# Altium schematic sheet MPU6050_Schematic.SchDoc
size A4
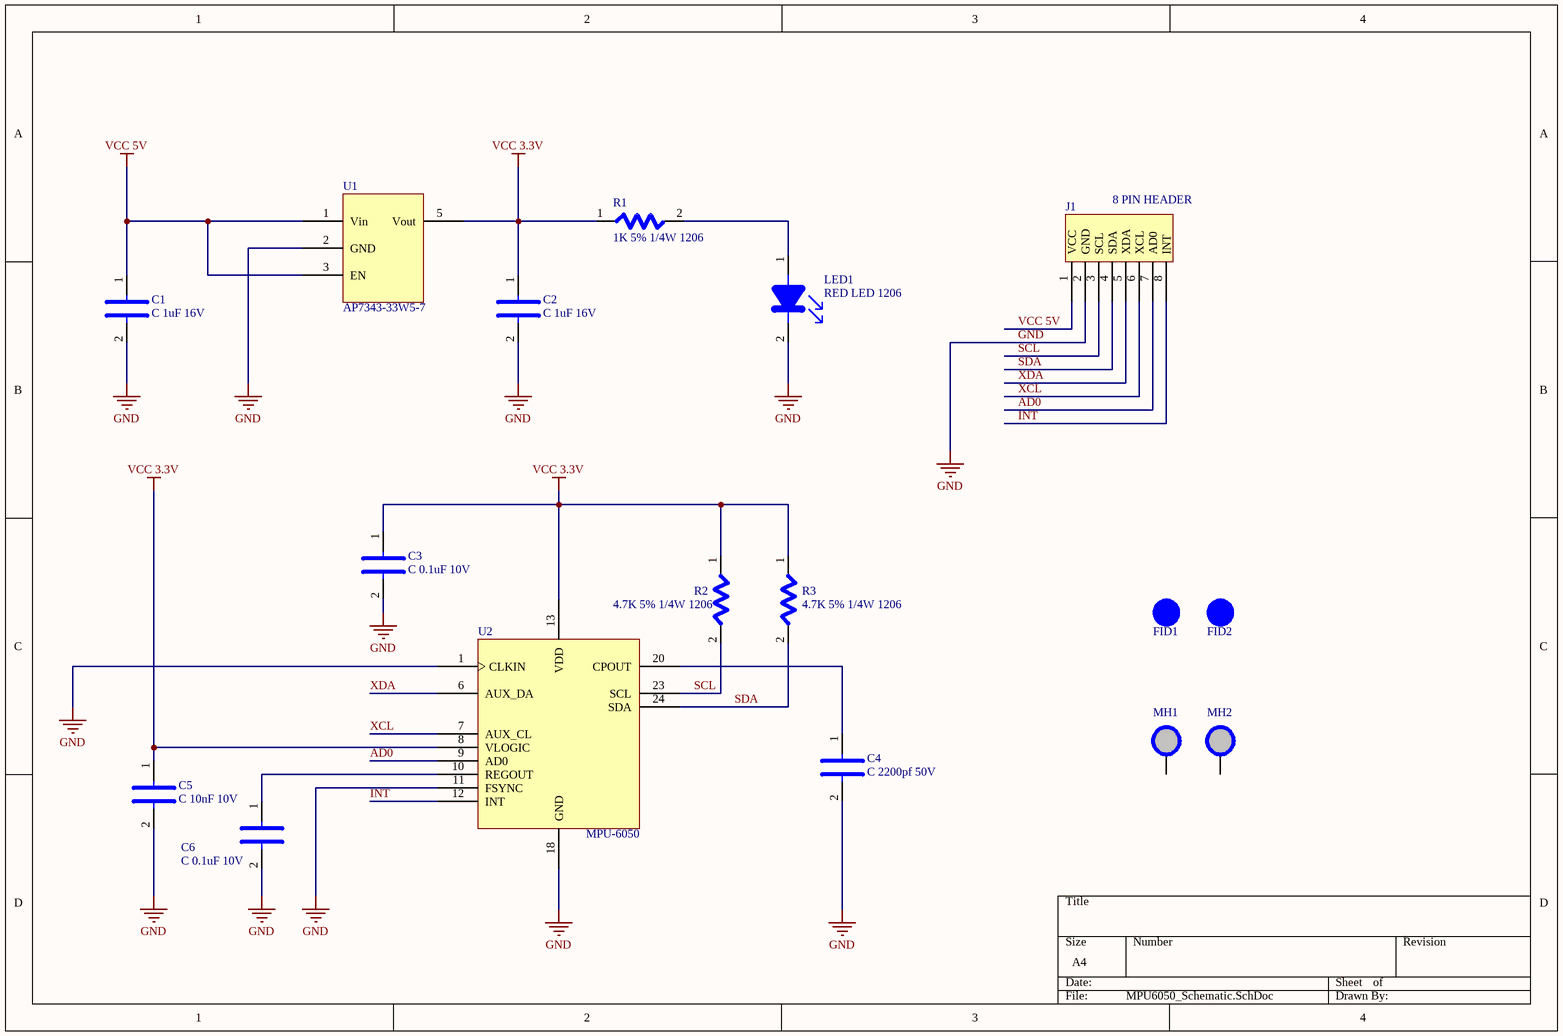
[diagram p0: MPU6050_Schematic.SchDoc]

## Parts
C1  C 1uF 16V  [CAP CER 1UF 10V X7R 1206]
C2  C 1uF 16V  [CAP CER 1UF 10V X7R 1206]
C3  C 0.1uF 10V  [CAP CER 0.1UF 10V X7R 1206]
C4  C 2200pf 50V  [CAP CER 2200PF 50V NP0 1206]
C5  C 10nF 10V  [CAP CER 1206 10NF 10V ULTRA STAB]
C6  C 0.1uF 10V  [CAP CER 0.1UF 10V X7R 1206]
FID1  FID_1mm  [FID_40_120]  (value not drawn)  (no BOM)
FID2  FID_1mm  [FID_40_120]  (value not drawn)  (no BOM)
J1  8 PIN HEADER  [CONN HEADER VERT 8POS 3.96MM]
LED1  RED LED 1206  [RES SMD 1K OHM 5% 1/4W 1206]
MH1  MH_3.2mmD  [MH 7.4mmD 3.2mmDirll No plated]  (value not drawn)  (no BOM)
MH2  MH_3.2mmD  [MH 7.4mmD 3.2mmDirll No plated]  (value not drawn)  (no BOM)
R1  1K 5% 1/4W 1206  [RES SMD 1K OHM 5% 1/4W 1206]
R2  4.7K 5% 1/4W 1206  [RES SMD 4.7K OHM 5% 1/4W 1206]
R3  4.7K 5% 1/4W 1206  [RES SMD 4.7K OHM 5% 1/4W 1206]
U1  AP7343-33W5-7  [AP7343-33W5-7]
U2  MPU-6050  [MPU6050]

## Nets
GND: C1.2 C2.2 C3.2 C4.2 C5.2 C6.2 J1.2(GND) LED1.2 U1.2(GND) U2.1(CLKIN) U2.11(FSYNC) U2.18(GND)
VCC 3.3V: C2.1 C3.1 C5.1 R1.1 R2.1 R3.1 U1.5(Vout) U2.8(VLOGIC) U2.13(VDD)
VCC 5V: C1.1 J1.1(VCC) U1.1(Vin) U1.3(EN)
AD0: J1.7(AD0) U2.9(AD0)
INT: J1.8(INT) U2.12(INT)
SCL: J1.3(SCL) R2.2 U2.23(SCL)
SDA: J1.4(SDA) R3.2 U2.24(SDA)
XCL: J1.6(XCL) U2.7(AUX_CL)
XDA: J1.5(XDA) U2.6(AUX_DA)
NetC4_1: C4.1 U2.20(CPOUT)
NetC6_1: C6.1 U2.10(REGOUT)
NetLED1_1: LED1.1 R1.2

Not connected (* = marked no-connect by the designer): MH1 1; MH2 1

## Library data of the parts
C1 C2 = CAP CER 1UF 10V X7R 1206: 1 µF ±10% 10V Capacitores cerámicos X7R 1206 (3216 métrico); Manufacturer: KEMET; Package/Case: 1206 (3216 métrico); Supplier: digikey; Supplier Part Number: 399-13193-1-ND; Package: Cinta cortada; Mount: Surface; Datasheet: https://content.kemet.com/datasheets/KEM_C1002_X7R_SMD.pdf; Pricing: 1=U$D0.78; 10=U$D0.578; 50=U$D0.462
C3 C6 = CAP CER 0.1UF 10V X7R 1206: 0.1 µF ±10% 10V Capacitores cerámicos X7R 1206 (3216 métrico); Manufacturer: KEMET; Package/Case: 1206 (3216 métrico); Supplier: digikey; Supplier Part Number: 399-15539-1-ND; Package: Cinta cortada; Mount: Surface; Datasheet: https://connect.kemet.com:7667/gateway/IntelliData-ComponentDocumentation/1.0/download/datasheet/C1206C104K8RACTU; Pricing: 1=U$D0.43; 10=U$D0.296; 50=U$D0.207
C4 = CAP CER 2200PF 50V NP0 1206: Manufacturer: KEMET; Package/Case: 1206 (3216 métrico); Supplier: digikey; Supplier Part Number: 399-C1206C222J5GACAUTOCT-ND; Package: Cinta cortada; Mount: Surface; Datasheet: https://content.kemet.com/datasheets/KEM_C1022_C0G_AUTO_SMD.pdf; Pricing: 1=U$D0.46; 10=U$D0.32; 50=U$D0.22
C5 = CAP CER 1206 10NF 10V ULTRA STAB: 10000 pF ±1% 10V Capacitores cerámicos X8R 1206 (3216 métrico); Manufacturer: KEMET; Package/Case: 1206 (3216 métrico); Supplier: digikey; Supplier Part Number: C1206C103F8HAC7800-ND; Package: Cinta y rollo; Mount: Surface; Datasheet: https://connect.kemet.com:7667/gateway/IntelliData-ComponentDocumentation/1.0/download/datasheet/C1206C103F8HAC7800; Pricing: 4000= U$D 0.143
FID1 FID2 = FID_1mm: Fiducial 40mil Diameter, 120mil Mask
J1 = CONN HEADER VERT 8POS 3.96MM: Cabezal de conector Orificio pasante 8 posiciones 0.156" (3.96mm); Manufacturer: TE Connectivity AMP Connectors; Supplier: digikey; Supplier Part Number: 644749-8-ND; Package: Cinta cortada; Mount: THT; Datasheet: https://www.te.com/commerce/DocumentDelivery/DDEController?Action=srchrtrv&DocNm=644749&DocType=Customer+Drawing&DocLang=English; Pricing: 750=U$D 0.654
LED1 = LED 1206 FLAT LENS RED: Rojo 630nm Indicación led: discreta 1.5V 1206 (3216 métrico); Manufacturer: Venkel; Package/Case: 1206 (3216 metrica); Supplier: digikey; Supplier Part Number: 2679-CTL1206FRD1TTR-ND; Package: Cinta y rollo; Mount: Surface; Datasheet: https://page.venkel.com/hubfs/Resources/Datasheets/LEDs/CTL1206FRD1T.pdf; Pricing: 3000=U$D 0.061
MH1 MH2 = MH_3.2mmD: MH 7..4mmD 3.2mmDrill Non plated
R1 = RES SMD 1K OHM 5% 1/4W 1206: 1 kOhms ±5% 0.25W, 1/4W Resistencia en microprocesador 1206 (3216 métrico) - Película gruesa; Manufacturer: Yageo; Package/Case: 1206 (3216 metrica); Supplier: digikey; Supplier Part Number: YAG1341CT-ND; Package: Cinta cortada; Mount: Surface; Datasheet: https://www.yageo.com/upload/media/product/productsearch/datasheet/rchip/PYu-RC_51_RoHS_P_2.pdf; Pricing: 1=U$D0.13; 10=U$D0.114; 100=U$D0.0439
R2 R3 = RES 4.7K OHM 5% 1/4W 1206: 4.7 kOhms ±5% 0.25W, 1/4W Resistencia en microprocesador 1206 (3216 métrico) Resistente a la humedad Película gruesa; Manufacturer: Yageo; Package/Case: 1206 (3216 metrica); Supplier: digikey; Supplier Part Number: 311-4.7KERCT-ND; Package: Cinta cortada; Mount: Surface; Datasheet: https://www.yageo.com/upload/media/product/productsearch/datasheet/rchip/PYu-RC_51_RoHS_P_2.pdf; Pricing: 1=U$D0.1; 10=U$D0.063; 100=U$D0.0258
U1 = AP7343-33W5-7: Low dropout regulator with high output voltage. 3.3V 300mA; Manufacturer: DIODES Incorporated; Output: 3.3A 300mA; Package/Case: SC-74A, SOT-753; Supplier: digikey; Supplier Part Number: AP7343-33W5-7DICT-ND; Package: Cinta cortada; Mount: Surface; Datasheet: https://www.diodes.com/assets/Datasheets/AP7343.pdf; Pricing: 1=U$D0.44; 10=U$D0.378; 25=U$D0.353; Manufacturer Part Number: AP7343-33W5-7
U2 = MPU-6050: Acelerometer, gyro, 6 axis; Manufacturer: TDK InvenSense; Package/Case: Módulo 24-VFQFN, Placa descubierta; Supplier: digikey; Supplier Part Number: 1428-1007-1-ND; Package: Cinta cortada; Mount: Surface; Datasheet: https://invensense.tdk.com/wp-content/uploads/2015/02/MPU-6000-Datasheet1.pdf; Pricing: 1=U$D9.11; 5=U$D7.99; 10=U$D7.19; 25=U$D6.39